# Altium project LED_Driver.PrjPcb
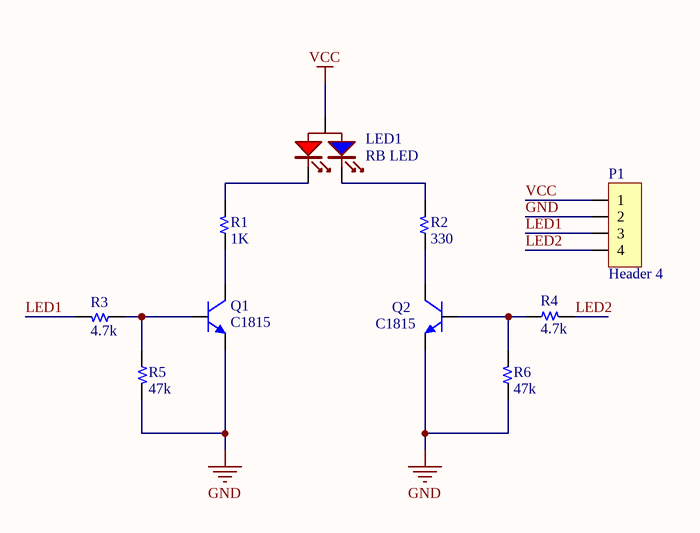
[diagram p0: LED_sch.SchDoc]
1 sheet, 10 parts. Net scope: global (net labels, ports and power ports of the same name join across sheets).
Board file: LED_PCB.PcbDoc

## Sheet LED_sch.SchDoc
size A

### Parts
LED1  RB LED  [LED-BICOLOR-3MM]
P1  Header 4  [HDR/Header/4/BOX/RED]
Q1  C1815  [SOT-23]
Q2  C1815  [SOT-23]
R1  1K  [R 0603]
R2  330  [R 0603]
R3  4.7k  [R 0603]
R4  4.7k  [R 0603]
R5  47k  [R 0603]
R6  47k  [R 0603]

### Nets
GND: P1.2 Q1.2(E) Q2.2(E) R5.2 R6.1
VCC: LED1.2(A) P1.1
LED1: P1.3 R3.2
LED2: P1.4 R4.2
NetLED1_1: LED1.1(K1) R1.2
NetLED1_3: LED1.3(K2) R2.2
NetQ1_1: Q1.1(B) R3.1 R5.1
NetQ1_3: Q1.3(C) R1.1
NetQ2_1: Q2.1(B) R4.1 R6.2
NetQ2_3: Q2.3(C) R2.1

### Library data of the parts
LED1 = LED 2-color-A: Bicolor RB 3mm LED
P1 = Header 4: Header, 4-Pin
Q1 Q2 = Transistor NPN: NPN Bipolar Transistor
R1-R6 = Resistor